# Altium schematic sheet Sheet1.SchDoc
size A4; SheetNumber: 2; SheetTotal: 2
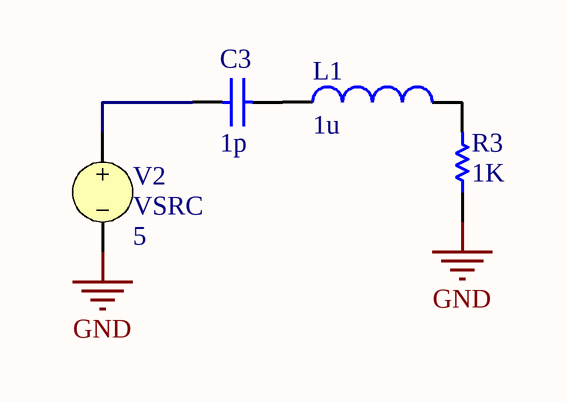
[diagram p0: Sheet1.SchDoc]

## Parts
C3  value 1p  (hidden comment: Capacitor)
L1  value 1u  (hidden comment: Inductor)
R3  value 1K  (hidden comment: Resistor)
V2  VSRC  value 5

## Nets
GND: R3.1 V2.2
NetC3_1: C3.1 V2.1
NetC3_2: C3.2 L1.1
NetL1_2: L1.2 R3.2

## Library data of the parts
C3 = Capacitor: SimulationGenericComponent: True
L1 = Inductor: SimulationGenericComponent: True
R3 = Resistor: TC1: 0; SimulationGenericComponent: True; TC2: 0
V2 = VSRC: Voltage Source; Note: PCB Footprint - Not required; AC Magnitude: 1; AC Phase: 0; Published: 30-July-2020; LatestRevisionDate: 30-July-2020; LatestRevisionNote: Re-released for DXP Platform.; PackageReference: Not Applicable; Publisher: Altium Limited